# EAGLE schematic MiniEsp v1.0 (EAGLE 7.2.0)
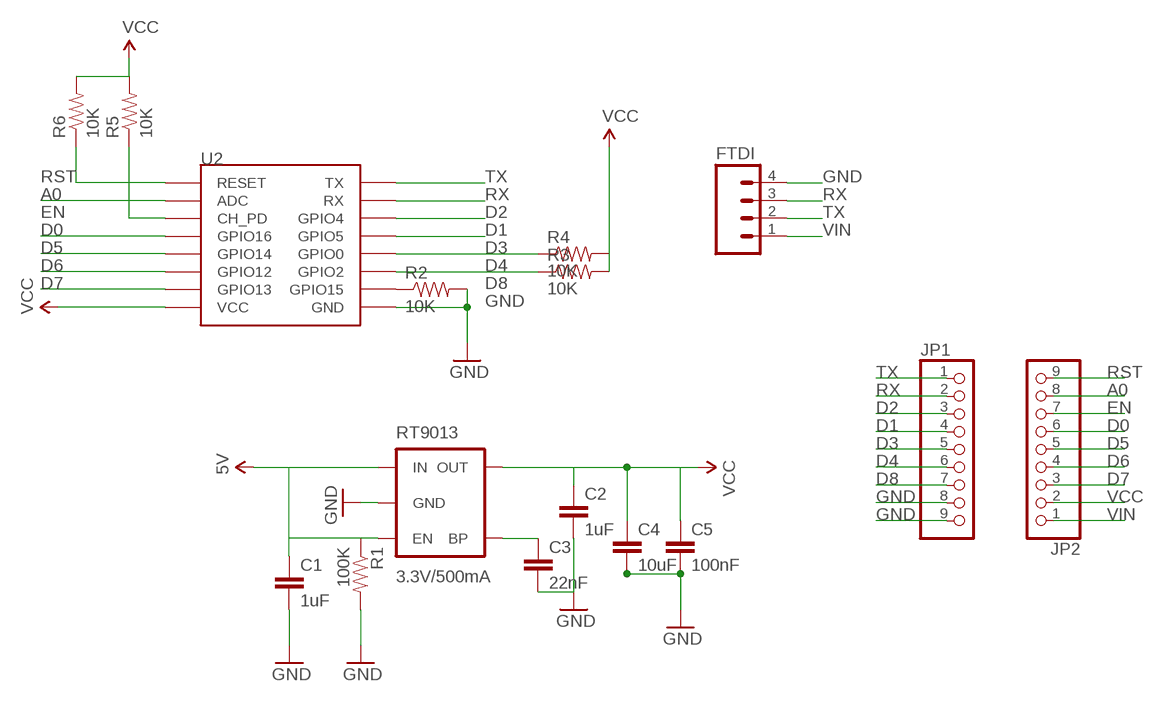
[diagram p0: schematic, sheet 1]

## Parts
C1  1uF  CAP0805  [0805]
C2  1uF  22UF-6.3V-20%(0805)  [0805]
C3  22nF  CAP0805  [0805]
C4  10uF  CAP0805  [0805]
C5  100nF  22UF-6.3V-20%(0805)  [0805]
FTDI  M04PTH  [1X04]
JP1  PINHD-1X9  [1X09-BIG]
JP2  PINHD-1X9  [1X09-BIG]
R1  100K  RESISTOR0805-RES  [0805]
R2  10K  RESISTOR0805-RES  [0805]
R3  10K  RESISTOR0805-RES  [0805]
R4  10K  RESISTOR0805-RES  [0805]
R5  10K  RESISTOR0805-RES  [0805]
R6  10K  RESISTOR0805-RES  [0805]
RT9013  3.3V/500mA  V_REG_MIC52053.3V  [SOT23-5]
U2  ESP12THROUGHOLE  [ESP12]

## Nets
A0: JP2.8 U2.ADC
BP: C3.1 RT9013.4(BP)
D0: JP2.6 U2.GPIO16
D1: JP1.4 U2.GPIO5
D2: JP1.3 U2.GPIO4
D3: JP1.5 R4.1 U2.GPIO0
D4: JP1.6 R3.1 U2.GPIO2
D5: JP2.5 U2.GPIO14
D6: JP2.4 U2.GPIO12
D7: JP2.3 U2.GPIO13
D8: JP1.7 R2.1 U2.GPIO15
EN: JP2.7 R5.1 U2.CH_PD
GND: C1.2 C2.2 C3.2 C4.2 C5.2 FTDI.4 JP1.8 JP1.9 R1.2 R2.2 RT9013.2(GND) U2.GND
RST: JP2.9 R6.1 U2.RESET
RX: FTDI.3 JP1.2 U2.RX
TX: FTDI.2 JP1.1 U2.TX
VCC: C2.1 C4.1 C5.1 JP2.2 R3.2 R4.2 R5.2 R6.2 RT9013.5(OUT) U2.VCC
VIN: C1.1 FTDI.1 JP2.1 R1.1 RT9013.1(IN) RT9013.3(EN) ; supply symbol labelled 5V

## Library data of the parts
C1 C3 C4 = SparkFun-Passives:CAP: Capacitor Standard 0603 ceramic capacitor, and 0.1" leaded capacitor.
C2 C5 = SparkFun-Capacitors:22UF-6.3V-20%(0805): CAP-08402 Ceramic; PROD_ID: CAP-08402; VALUE: 22uF
FTDI = SparkFun-Connectors:M04: Header 4 Standard 4-pin 0.1" header. Use with straight break away headers (SKU : PRT-00116), right angle break away headers (PRT-00553), swiss pins (PRT-00743), machine pins (PRT-00117), and female headers (PRT-00115). Molex polarized connector foot print use with SKU : PRT-08231 with associated crimp pins and housings. 1MM SMD Version SKU: PRT-10208
JP1 JP2 = adafruit:PINHD-1X9: Pin header 1x10 0.1" spacing With round pins
R1-R6 = SparkFun-Passives:RESISTOR: Resistor Basic schematic elements and footprints for 0603, 1206, and PTH resistors.
RT9013 = SparkFun-PowerIC:V_REG_MIC5205: V_REG MIC5205 Standard 3.3V, 5V, and Adjustable 150mA LDO voltage regulator in SOT-23 layout. Micrel part MIC5205. BP (by-pass) pin is used to lower output noise with 470pF cap, may be left open. On the adjustable version BP is used to set output.; PROD_ID: VREG-00822; VALUE: 3.3V/150mA
U2 = esp8266modules:ESP12: ESP8266 Wifi module 12